# EAGLE design simple-power-monitor (EAGLE 7.6.0)
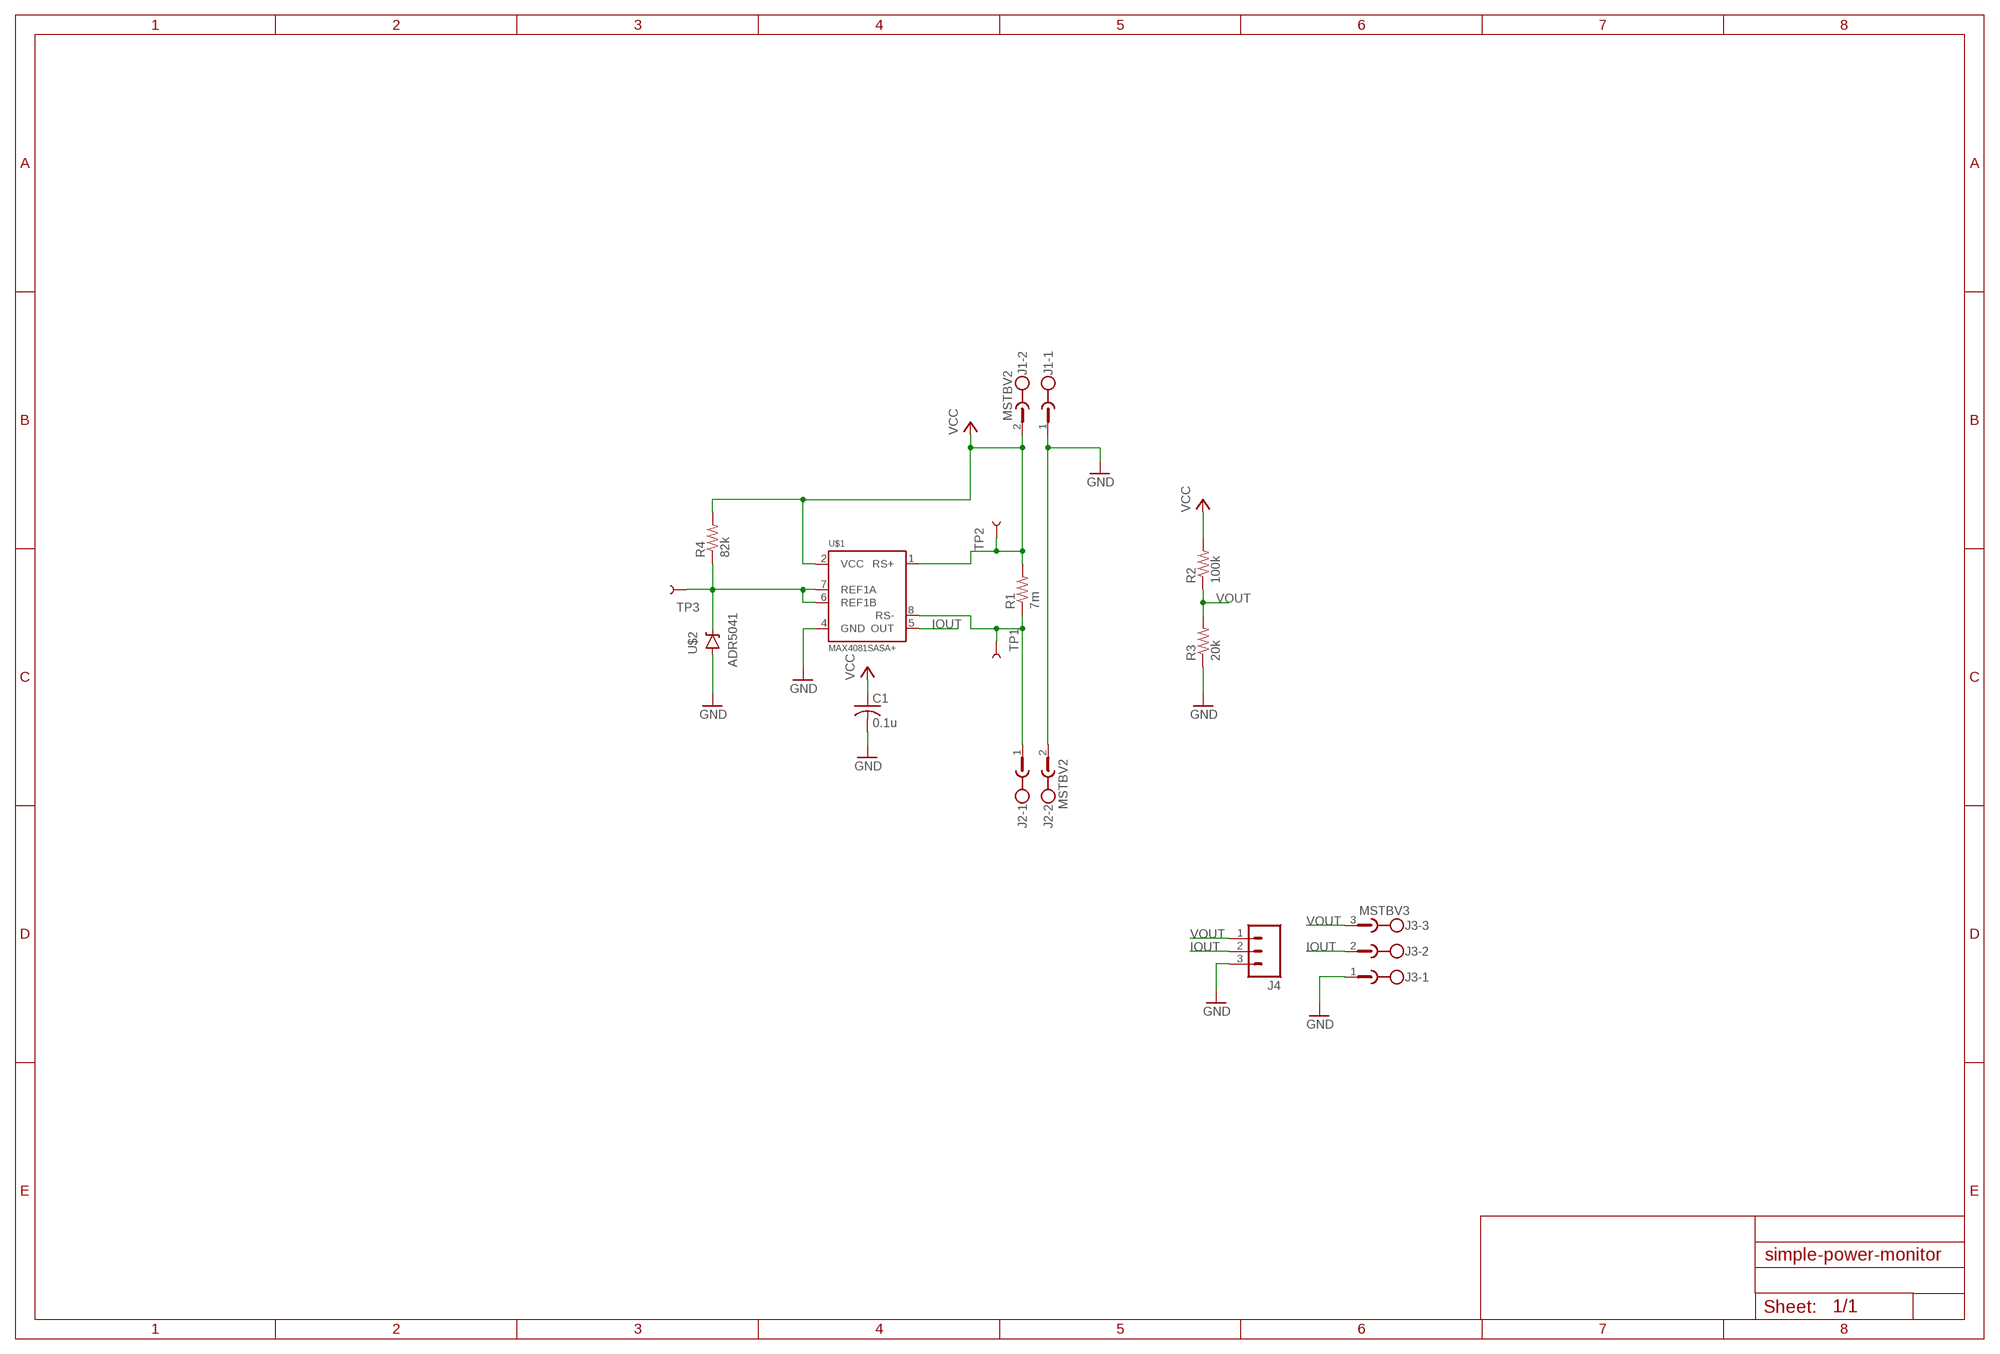
[diagram p0: schematic, sheet 1]

## Parts
C1  0.1u  C-USC0805K  [C0805K]
J1  MSTBV2  [MSTBV2]
J2  MSTBV2  [MSTBV2]
J3  MSTBV3  [MSTBV3]
J4  M03PTH  [1X03]
R1  7m  R-US_R2010  [R2010]
R2  100k  R-US_R0805  [R0805]
R3  20k  R-US_R0805  [R0805]
R4  82k  R-US_R0805  [R0805]
TP1  TEST-POINTTP_15TH_THRU  [TP_15TH]
TP2  TEST-POINTTP_15TH_THRU  [TP_15TH]
TP3  TEST-POINTTP_15TH_THRU  [TP_15TH]
U$1  MAX4081SASA+  [SO8]
U$2  ADR5041  [SOT23-3]

## Nets
GND: C1.2 J1.1 J2.2 J3.1 J4.3 R3.1 U$1.4(GND) U$2.2(A)
IOUT: J3.2 J4.2 U$1.5(OUT)
N$1: R4.1 TP3.P$1 U$1.6(REF1B) U$1.7(REF1A) U$2.1(C)
RS+: J2.1 R1.1 TP1.P$1 U$1.8(RS-)
VCC: C1.1 J1.2 R1.2 R2.2 R4.2 TP2.P$1 U$1.1(RS+) U$1.2(VCC)
VOUT: J3.3 J4.1 R2.1 R3.2

## Library data of the parts
C1 = resistor:C-US: CAPACITOR, American symbol
J1 J2 = con-phoenix-508:MSTBV2: PHOENIX; MPN: MSTBV 2,5/2-GF-5.08; OC_FARNELL: 1792792; OC_NEWARK: 69R9845
J3 = con-phoenix-508:MSTBV3: PHOENIX; MPN: MSTBV 2,5/3-GF-5.08; OC_FARNELL: 1792793; OC_NEWARK: 69R9846
J4 = SparkFun-Connectors:M03: Header 3 Standard 3-pin 0.1" header. Use with straight break away headers (SKU : PRT-00116), right angle break away headers (PRT-00553), swiss pins (PRT-00743), machine pins (PRT-00117), and female headers (PRT-00115). Molex polarized connector foot print use with SKU : PRT-08232 with associated crimp pins and housings.
R1-R4 = resistor:R-US_: RESISTOR, American symbol
TP1-TP3 = SparkFun-Passives:TEST-POINT: Bare copper test points for troubleshooting or ICT
U$1 = simple-power-monitor:MAX4081SASA+
U$2 = simple-power-monitor:ADR5041

## Board
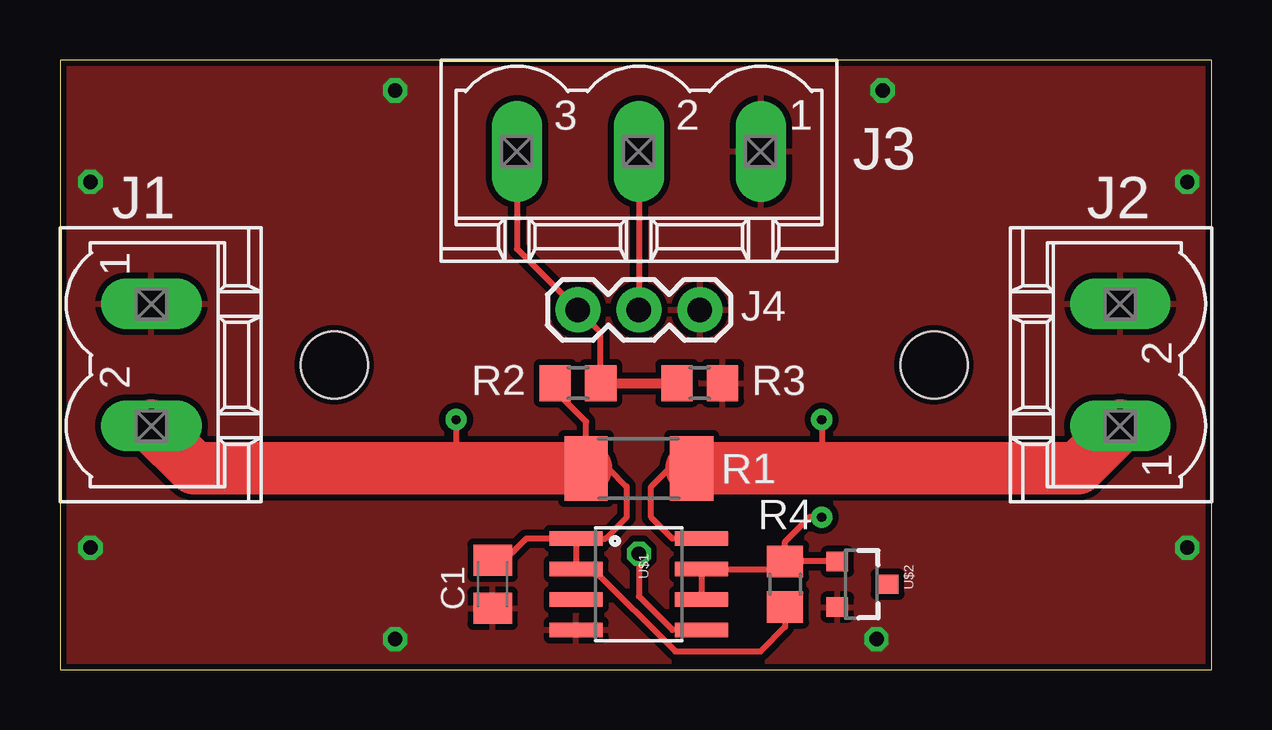
[diagram p1: board, top side]
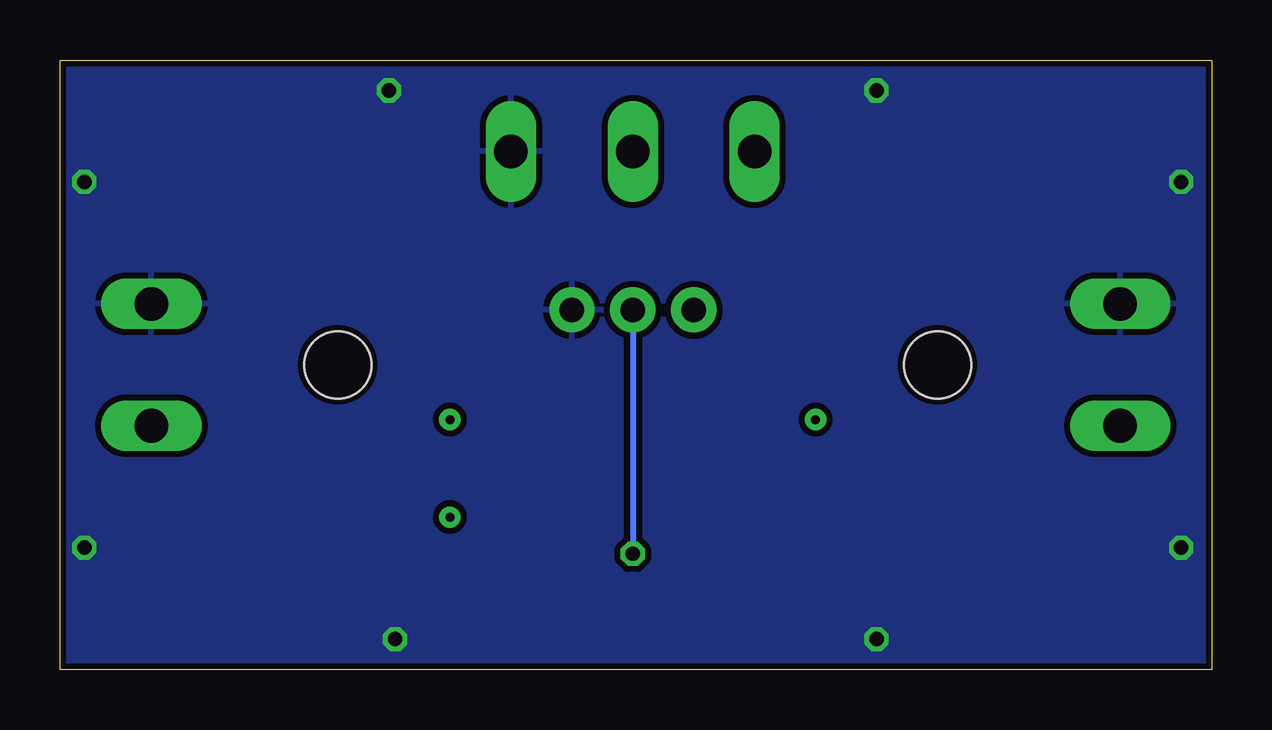
[diagram p2: board, bottom side, seen from below]

Size 48.01 x 25.4 mm. Coordinates in mm from the lower left corner, seen from the top.
Outline: 0,0 48.01,0 48.01,25.4 0,25.4 0,0
Copper layers (1*16): Top 0.035mm / dielectric 1.5mm / Bottom 0.035mm
Design rules "default *": minimum track width 10mil, minimum drill 24mil, track to track 8mil, track to pad 8mil, pad to pad 8mil, via to via 8mil, smd to smd 8mil, copper to edge 10mil, drill to drill 8mil, minimum pad ring 10mil, minimum via ring 8mil, stop-mask expansion 4mil, vias tented up to drill 0mil, thermal gap 10mil
Holes 2.79 mm at 11.43,12.7 36.43,12.7

### Footprints (pad centres in the part's own frame; a part is rotated, then mirrored left to right if it is on the bottom)
C0805K = smd 1.3 x 1.6: 1 -1,0; 2 1,0
MSTBV2 = drill 1.397 long: 1 -2.54,0; 2 2.54,0
MSTBV3 = drill 1.397 long: 1 -5.08,0; 2 0,0; 3 5.08,0
1X03 = drill 1.016 pad 1.88: 1 0,0; 2 2.54,0; 3 5.08,0
R2010 = smd 1.8 x 2.7: 1 -2.2,0; 2 2.2,0
R0805 = smd 1.3 x 1.5: 1 -0.95,0; 2 0.95,0
TP_15TH = drill 0.381 pad 0.61: P$1 0,0
SO8 = smd 0.61 x 2.21: 1 -1.905,-2.616; 2 -0.635,-2.616; 3 0.635,-2.616; 4 1.905,-2.616; 5 1.905,2.616; 6 0.635,2.616; 7 -0.635,2.616; 8 -1.905,2.616
SOT23-3 = smd 0.8 x 0.9: 1 -0.95,-1; 2 0.95,-1; 3 0,1.1

### Placement (x,y rotation side)
C1  18.03,3.56 270 top
J1  3.81,12.7 270 top
J2  44.2,12.7 90 top
J3  24.13,21.59 180 top
J4  21.59,14.99 0 top
R1  24.13,8.38 180 top
R2  21.59,11.94 180 top
R3  26.67,11.94 180 top
R4  30.23,3.56 270 top
TP1  31.75,10.41 0 top
TP2  16.51,10.41 0 top
TP3  31.75,6.35 0 top
U$1  24.13,3.56 270 top
U$2  33.4,3.56 270 top

### Tracks (layer width: path | path; a pad name or v marks a point on that pad's centre or on a via)
GND  (via drill 0.6)
  other vias: 1.27,20.32 1.27,5.08 13.97,1.27 34.04,1.27 46.99,5.08 46.99,20.32 34.29,24.13 13.97,24.13
  pour Bottom (isolate 0.254): 0,0 48.01,0 48.01,25.4 0,25.4
  pour Top (isolate 0.254): 0,0 48.01,0 48.01,25.4 0,25.4
IOUT  (via drill 0.6)
  Top 0.254: J3.2 J4.2 | U$1.5 25.53,1.65 24.13,3.05 v24.13,4.83
  Bottom 0.254: J4.2 v24.13,4.83
N$1
  Top 0.254: U$1.6 U$1.7 29.91,4.19 R4.1 | U$2.1 R4.1 | TP3.P$1 31.24,6.35 30.23,5.33 R4.1
RS+
  Top 0.254: 26.75,7.97 R1.1 25.4,8.38 24.64,7.62 24.64,6.35 25.53,5.46 U$1.8 | TP1.P$1 31.75,8.38
  Top 2.184: R1.1 31.75,8.38 42.42,8.38 J2.1
VCC
  Top 0.254: R4.2 30.23,1.78 29.21,0.76 25.65,0.76 22.23,4.19 U$1.2 U$1.1 | R2.2 20.64,11.62 21.93,10.33 R1.2 22.86,8.38 23.62,7.62 23.62,6.35 22.73,5.46 U$1.1 | TP2.P$1 16.51,8.38 | C1.1 18.53,4.56 19.43,5.46 U$1.1
  Top 2.184: R1.2 16.51,8.38 5.59,8.38 J1.2
VOUT
  Top 0.254: J3.3 19.05,17.53 J4.1 22.54,14.04 R2.1
  Top 0.406: R2.1 R3.2